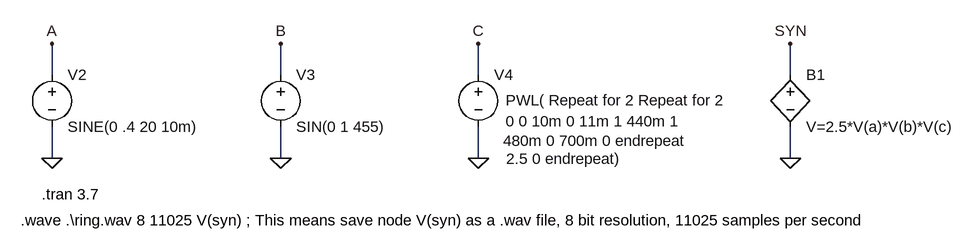
[diagram p0: schematic WaveOut.asc]
WaveOut.asc, the LTspice schematic file:
Version 4
SHEET 1 2868 848
WIRE 1008 560 1008 512
WIRE 1360 560 1360 512
WIRE 1664 560 1664 512
WIRE 2144 560 2144 512
WIRE 1008 688 1008 640
WIRE 1360 688 1360 640
WIRE 1664 688 1664 640
WIRE 2144 688 2144 640
FLAG 1008 688 0
FLAG 1360 688 0
FLAG 1008 512 A
FLAG 1360 512 B
FLAG 2144 688 0
FLAG 1664 688 0
FLAG 1664 512 C
FLAG 2144 512 SYN
SYMBOL VOLTAGE 1008 544 R0
WINDOW 39 0 0 Left 0
WINDOW 123 0 0 Left 0
SYMATTR InstName V2
SYMATTR Value SINE(0 .4 20 10m)
SYMBOL voltage 1360 544 R0
SYMATTR InstName V3
SYMATTR Value SIN(0 1 455)
SYMBOL BV 2144 544 R0
SYMATTR InstName B1
SYMATTR Value V=2.5*V(a)*V(b)*V(c)
SYMBOL voltage 1664 544 R0
WINDOW 3 42 55 Left 0
WINDOW 40 43 145 Left 0
WINDOW 39 38 117 Left 0
WINDOW 123 42 87 Left 0
SYMATTR Value PWL( Repeat for 2 Repeat for 2
SYMATTR SpiceLine2 2.5 0 endrepeat)
SYMATTR SpiceLine 480m 0 700m 0 endrepeat
SYMATTR Value2 0 0 10m 0 11m 1 440m 1
SYMATTR InstName V4
TEXT 992 744 Left 0 !.tran 3.7
TEXT 960 784 Left 0 !.wave .\\ring.wav 8 11025 V(syn) ; This means save node V(syn) as a .wav file, 8 bit resolution, 11025 samples per second

The netlist it stands for:
* WaveOut.asc
V2 A 0 SINE(0 .4 20 10m)
V3 B 0 SIN(0 1 455)
B1 SYN 0 V=2.5*V(a)*V(b)*V(c)
V4 C 0 PWL( Repeat for 2 Repeat for 2 0 0 10m 0 11m 1 440m 1 480m 0 700m 0 endrepeat 2.5 0 endrepeat)
.tran 3.7
.wave .\ring.wav 8 11025 V(syn) ; This means save node V(syn) as a .wav file, 8 bit resolution, 11025 samples per second
.backanno
.end